# EAGLE schematic shield (EAGLE 9.5.2)
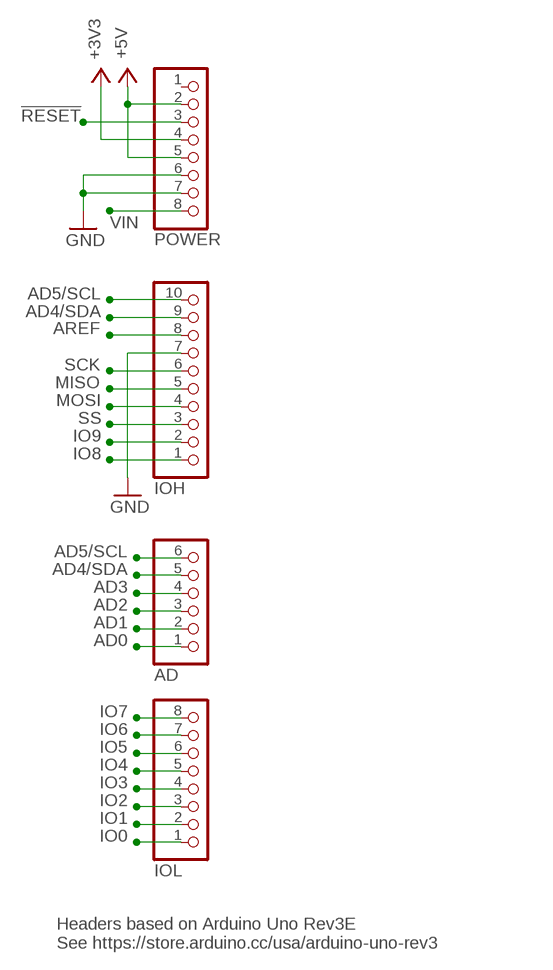
[diagram p0: schematic, sheet 1]

## Parts
AD  6x1F-H8.5  PINHD-1X6  [1X06]
IOH  10x1F-H8.5  PINHD-1X10_ARD  [1X10]
IOL  8x1F-H8.5  PINHD-1X8  [1X08]
POWER  8x1F-H8.5  PINHD-1X8  [1X08]

## Nets
!RESET: POWER.3
+3V3: POWER.4
+5V: POWER.2 POWER.5
AD0: AD.1
AD1: AD.2
AD2: AD.3
AD3: AD.4
AD4/SDA: AD.5 IOH.9
AD5/SCL: AD.6 IOH.10
AREF [aref]: IOH.8
GND [gnd]: IOH.7 POWER.6 POWER.7
IO0: IOL.1
IO1: IOL.2
IO2: IOL.3
IO3: IOL.4
IO4: IOL.5
IO5: IOL.6
IO6: IOL.7
IO7: IOL.8
IO8: IOH.1
IO9: IOH.2
MISO: IOH.5
MOSI: IOH.4
SCK: IOH.6
SS: IOH.3
VIN [power]: POWER.8
Unconnected: POWER.1

## Notes on the sheet
- Headers based on Arduino Uno Rev3E
  See https://store.arduino.cc/usa/arduino-uno-rev3

## Library data of the parts
AD = SmartPrj:PINHD-1X6: PIN HEADER
IOH = SmartPrj:PINHD-1X10_ARD: PIN HEADER
IOL POWER = SmartPrj:PINHD-1X8: PIN HEADER

## Net classes
0 default: width 0.254 mm, clearance 0.254 mm
1 power: width 0.61 mm, drill 0.61 mm, clearance 0.254 mm
2 gnd: width 0.305 mm, drill 0.559 mm, clearance 0.254 mm
3 usbvcc: width 0.508 mm, drill 0.61 mm, clearance 0.254 mm
4 aref: width 0.406 mm, drill 0.61 mm, clearance 0.254 mm